# EAGLE schematic Assignment4B-IR-Sensor Schematic.sch (EAGLE 9.6.2)
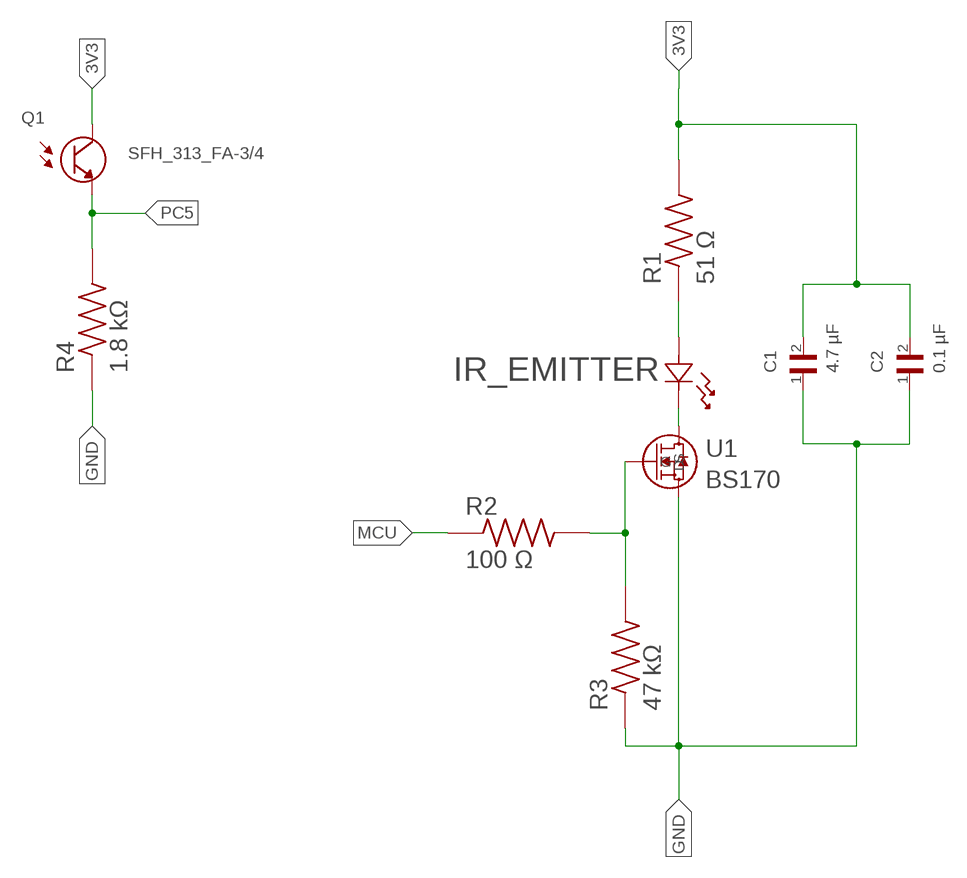
[diagram p0: schematic, sheet 1]

## Parts
C1  4.7 µF  GRM21BR71C475KE51L  [CAPC2012X140N]
C2  0.1 µF  GCM21BR72A104KA37K  [CAPC2012X140N]
LED1  IR_EMITTER  INL-5AMIR15  [LED_INL-5AMIR15_INO]
Q1  SFH_313_FA-3/4  [XDCR_SFH_313_FA-3/4]
R1  51 Ω  CRCW080551R0FKEAHP  [RESC2012X60N]
R2  100 Ω  CRCW0805100RFKEAHP  [RESC2012X60N]
R3  47 kΩ  CRCW080547K0JNEA  [RESC2012X50N]
R4  1.8 kΩ  CRCW08051K80FKEB  [RESC2012X50N]
U1  BS170  [TO_SA06_ONS]

## Nets
3V3: C1.2 C2.2 Q1.2(C) R1.2
GND: C1.1 C2.1 R3.1 R4.1 U1.3(S)
MCU: R2.1
N$1: R2.2 R3.2 U1.1(G)
N$3: LED1.1 U1.2(D)
N$4: LED1.2 R1.1
PC5: Q1.1(E) R4.2

## Library data of the parts
C1 = GRM21BR71C475KE51L:GRM21BR71C475KE51L: SMD Capacitor X7R(EIA) with Capacitance: 4.7uF Tol. 10%. Rated Voltage: 16Vdc; CHECK_PRICES: https://www.snapeda.com/parts/GRM21BR71C475KE51L/Murata/view-part/?ref=eda; DESCRIPTION: 4.7 µF ±10% 16V Ceramic Capacitor X7R 0805 (2012 Metric); DIGIKEY_PART_NUMBER: 490-14466-2-ND; MF: Murata Electronics; MP: GRM21BR71C475KE51L; PACKAGE: 0805 Murata Electronics; PURCHASE-URL: https://www.snapeda.com/api/url_track_click_mouser/?unipart_id=5514957&manufacturer=Murata Electronics&part_name=GRM21BR71C475KE51L&search_term=None; SNAPEDA_LINK: https://www.snapeda.com/parts/GRM21BR71C475KE51L/Murata/view-part/?ref=snap
C2 = GCM21BR72A104KA37K:GCM21BR72A104KA37K; CHECK_PRICES: https://www.snapeda.com/parts/GCM21BR72A104KA37K/Murata+Electronics+North+America/view-part/?ref=eda; DESCRIPTION: 0.1 µF ±10% 100V Ceramic Capacitor X7R 0805 (2012 Metric); MF: Murata; MP: GCM21BR72A104KA37K; PACKAGE: 2012 Murata; PURCHASE-URL: https://www.snapeda.com/api/url_track_click_mouser/?unipart_id=1756077&manufacturer=Murata&part_name=GCM21BR72A104KA37K&search_term=None; SNAPEDA_LINK: https://www.snapeda.com/parts/GCM21BR72A104KA37K/Murata+Electronics+North+America/view-part/?ref=snap
LED1 = IR_Emitter:INL-5AMIR15; COPYRIGHT: Copyright (C) 2024 Ultra Librarian. All rights reserved.; DIGIKEY_PART_NUMBER_1: 1830-INL-5AMIR15-ND; MANUFACTURER_PART_NUMBER: INL-5AMIR15; MFR_NAME: Inolux
Q1 = SFH_313_FA-3_4:SFH_313_FA-3/4: Phototransistor IR Chip Silicon 870nm 2-Pin T-1 3/4; CHECK_PRICES: https://www.snapeda.com/parts/SFH%20313%20FA-3/4/OSRAM+Opto+Semiconductors+Inc./view-part/?ref=eda; DESCRIPTION: Phototransistors 870nm Top View Radial - 2 Leads; DIGIKEY_PART_NUMBER: 475-SFH313FA-3/4-ND; MF: OSRAM Opto; MP: SFH 313 FA-3/4; PACKAGE: Radial-2 OSRAM Opto; SNAPEDA_LINK: https://www.snapeda.com/parts/SFH%20313%20FA-3/4/OSRAM+Opto+Semiconductors+Inc./view-part/?ref=snap
R1 = CRCW080551R0FKEAHP:CRCW080551R0FKEAHP; CHECK_PRICES: https://www.snapeda.com/parts/CRCW080551R0FKEAHP/Vishay/view-part/?ref=eda; DESCRIPTION: Resistor;Thick Film;51 Ohms;0.33 W;1%;SMT;0805;TCR 37 ppm/DegC | Vishay Dale CRCW080551R0FKEAHP; DIGIKEY_PART_NUMBER: 541-51.0TTR-ND; MF: Vishay; MP: CRCW080551R0FKEAHP; PACKAGE: 2012 Bourns; SNAPEDA_LINK: https://www.snapeda.com/parts/CRCW080551R0FKEAHP/Vishay/view-part/?ref=snap
R2 = CRCW0805100RFKEAHP:CRCW0805100RFKEAHP: CRCW0805-HP 100 100R 1% ET1 E3; CHECK_PRICES: https://www.snapeda.com/parts/CRCW0805100RFKEAHP/Vishay+Dale/view-part/?ref=eda; DESCRIPTION: Resistor;Thick Film;100 Ohms;0.33 W;1%;SMT;0805;TCR 37 ppm/DegC | Vishay Dale CRCW0805100RFKEAHP; DIGIKEY_PART_NUMBER: 541-100TTR-ND; MF: Vishay; MP: CRCW0805100RFKEAHP; PACKAGE: 2012 Bourns; PURCHASE-URL: https://www.snapeda.com/api/url_track_click_mouser/?unipart_id=984567&manufacturer=Vishay&part_name=CRCW0805100RFKEAHP&search_term=None; SNAPEDA_LINK: https://www.snapeda.com/parts/CRCW0805100RFKEAHP/Vishay+Dale/view-part/?ref=snap
R3 = CRCW080547K0JNEA:CRCW080547K0JNEA: Resistor; Thick Film; 47 Kilohms; 0.125 W; 5%; SMT; 0805; TCR 73 ppm/DegC; Tape and Reel; CHECK_PRICES: https://www.snapeda.com/parts/CRCW080547K0JNEA/Vishay+Dale/view-part/?ref=eda; DESCRIPTION: Resistor,Thick Film,47 Kilohms,0.125 W,5%,SMT,0805,TCR 73 ppm/DegC,Cut Tape | Vishay Dale CRCW080547K0JNEA; DIGIKEY_PART_NUMBER: 541-47KATR-ND; MF: Vishay Dale; MP: CRCW080547K0JNEA; PACKAGE: 2012 Vishay; PURCHASE-URL: https://www.snapeda.com/api/url_track_click_mouser/?unipart_id=614704&manufacturer=Vishay Dale&part_name=CRCW080547K0JNEA&search_term=None; SNAPEDA_LINK: https://www.snapeda.com/parts/CRCW080547K0JNEA/Vishay+Dale/view-part/?ref=snap
R4 = CRCW08051K80FKEB:CRCW08051K80FKEB: RES SMD 1.8K OHM 1% 1/8W 0805; CHECK_PRICES: https://www.snapeda.com/parts/CRCW08051K80FKEB/Vishay+Dale/view-part/?ref=eda; DESCRIPTION: 1.8 kOhms ±1% 0.125W, 1/8W Chip Resistor 0805 (2012 Metric) Automotive AEC-Q200 Thick Film; DIGIKEY_PART_NUMBER: 541-CRCW08051K80FKEBTR-ND; MF: Vishay Dale; MP: CRCW08051K80FKEB; PACKAGE: 2012 Vishay; PURCHASE-URL: https://www.snapeda.com/api/url_track_click_mouser/?unipart_id=943539&manufacturer=Vishay Dale&part_name=CRCW08051K80FKEB&search_term=None; SNAPEDA_LINK: https://www.snapeda.com/parts/CRCW08051K80FKEB/Vishay+Dale/view-part/?ref=snap
U1 = MOSFET:BS170; COPYRIGHT: Copyright (C) 2024 Ultra Librarian. All rights reserved.; DIGIKEY_PART_NUMBER_1: 2156-BS170-ND; DIGIKEY_PART_NUMBER_2: 2156-BS170-OS-ND; DIGIKEY_PART_NUMBER_3: 2368-BS170-ND; DIGIKEY_PART_NUMBER_4: BS170-ND; DIGIKEY_PART_NUMBER_5: BS170DICT-ND; DIGIKEY_PART_NUMBER_6: BS170DITB-ND; DIGIKEY_PART_NUMBER_7: BS170OS-ND; MANUFACTURER_PART_NUMBER: BS170; MFR_NAME: onsemi